# Altium project PROJET.PrjPcb
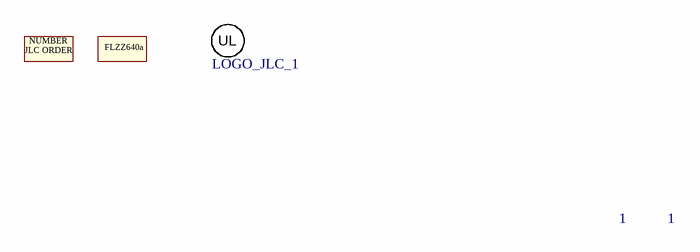
[diagram p0: ALTIUM.SchDoc]
Entreprise: NGV Electronique; ProjetAddress1: Rue de l'Acadie; ProjetAddress2: Parc du Carteron; ProjetAddress3: 49300 CHOLET; ProjetPCB: FLZZ640a
1 sheet, 3 parts. Net scope: global (net labels, ports and power ports of the same name join across sheets).
Board files: ALTIUM.PcbDoc, FLAN.PcbDoc, FLAN0.PCBDOC

## Sheet ALTIUM.SchDoc: =VariantTitre
size A3; DrawnBy: BE NGV ELECTRONIQUE

### Parts
LOGO_1  LOGO_JLC_ORDER_NUMBER  [JLC_ORDER_NUMBER]  (value not drawn)  (no BOM)
LOGO_JLC_1  LOGO_JLC_UL_2_LAYERS  [LOGO_UL_JLC2]  (value not drawn)  (no BOM)
REF_CARTOUCHE_PCB:1  FLZZ640a  [LogoRefCuivre]  (no BOM)

### Notes on the sheet
- 1
- Ind:
- Date:
- Evolution:
- Title
- Ref:
- Sheet
- PCB:
- of
- NGV Electronique
- Rue de l'Acadie
- Parc du Carteron
- 49300 CHOLET
- File:
- DrawnBy
- BE NGV ELECTRONIQUE
- (in symbol LOGO_JLC_ORDER_NUMBER) NUMBER; JLC ORDER
- (in symbol LOGO_JLC_UL_2_LAYERS) UL

### Library data of the parts
LOGO_1 = LOGO_JLC_ORDER_NUMBER: Logo CE (sérigraphie)
LOGO_JLC_1 = LOGO_JLC_UL_2_LAYERS: Logo CE (sérigraphie)
REF_CARTOUCHE_PCB:1 = LOGO_Cuivre: Référence Cuivre (sérigraphie)

## Assembly variants
ZZZZ9998: all parts fitted
ZZZZ9998_Cms: all parts fitted
ZZZZ9998_Vague: all parts fitted